# Altium project PCB_Project.PrjPcb (part 1 of 2)
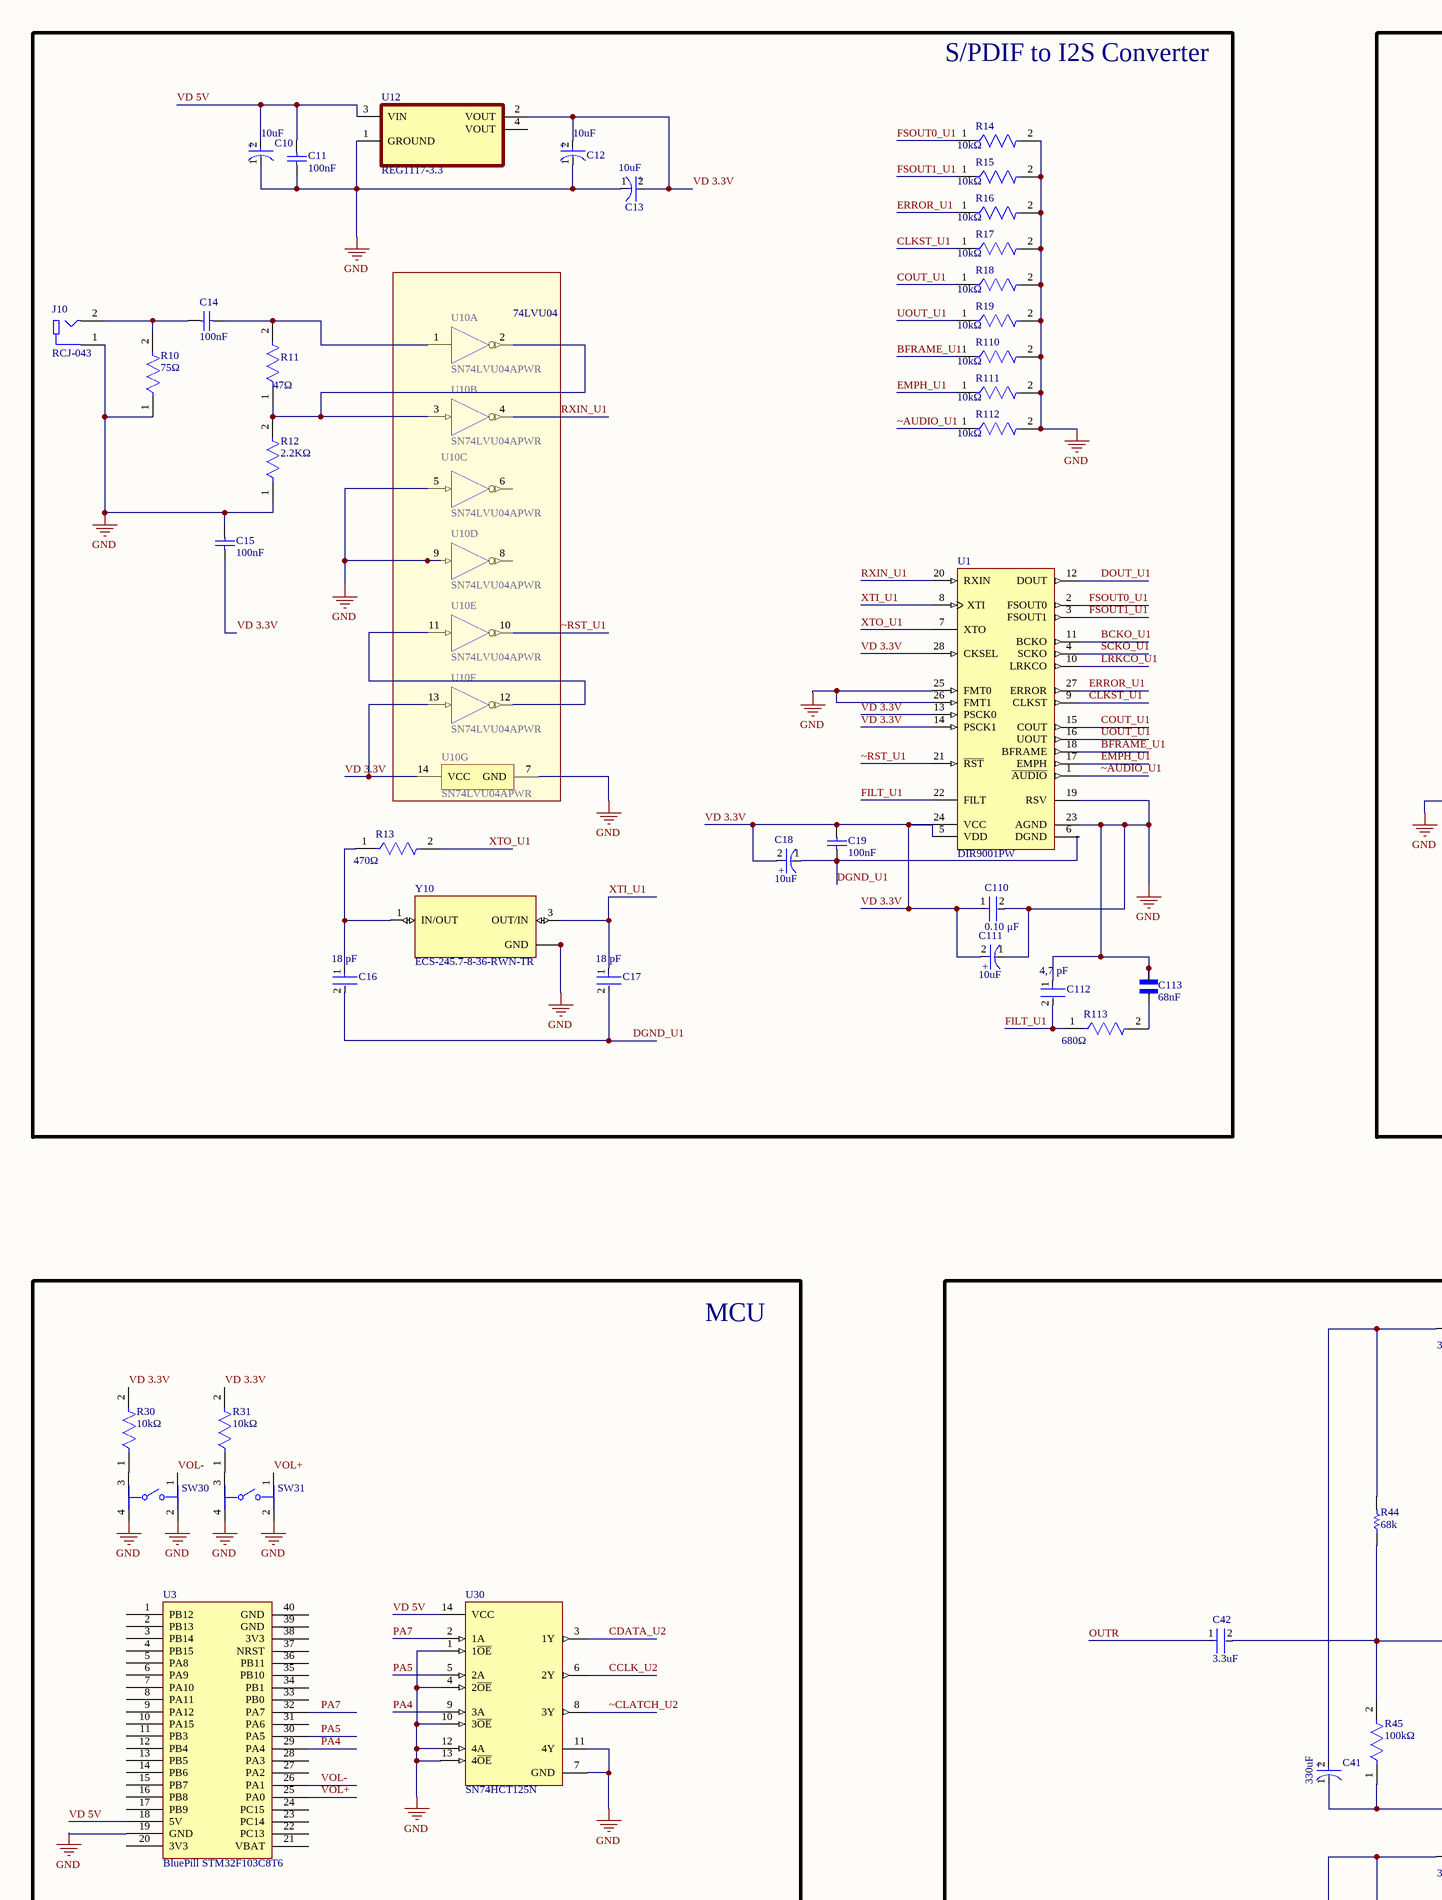
[diagram p0: Wzmacniacz audio.SchDoc, top left]
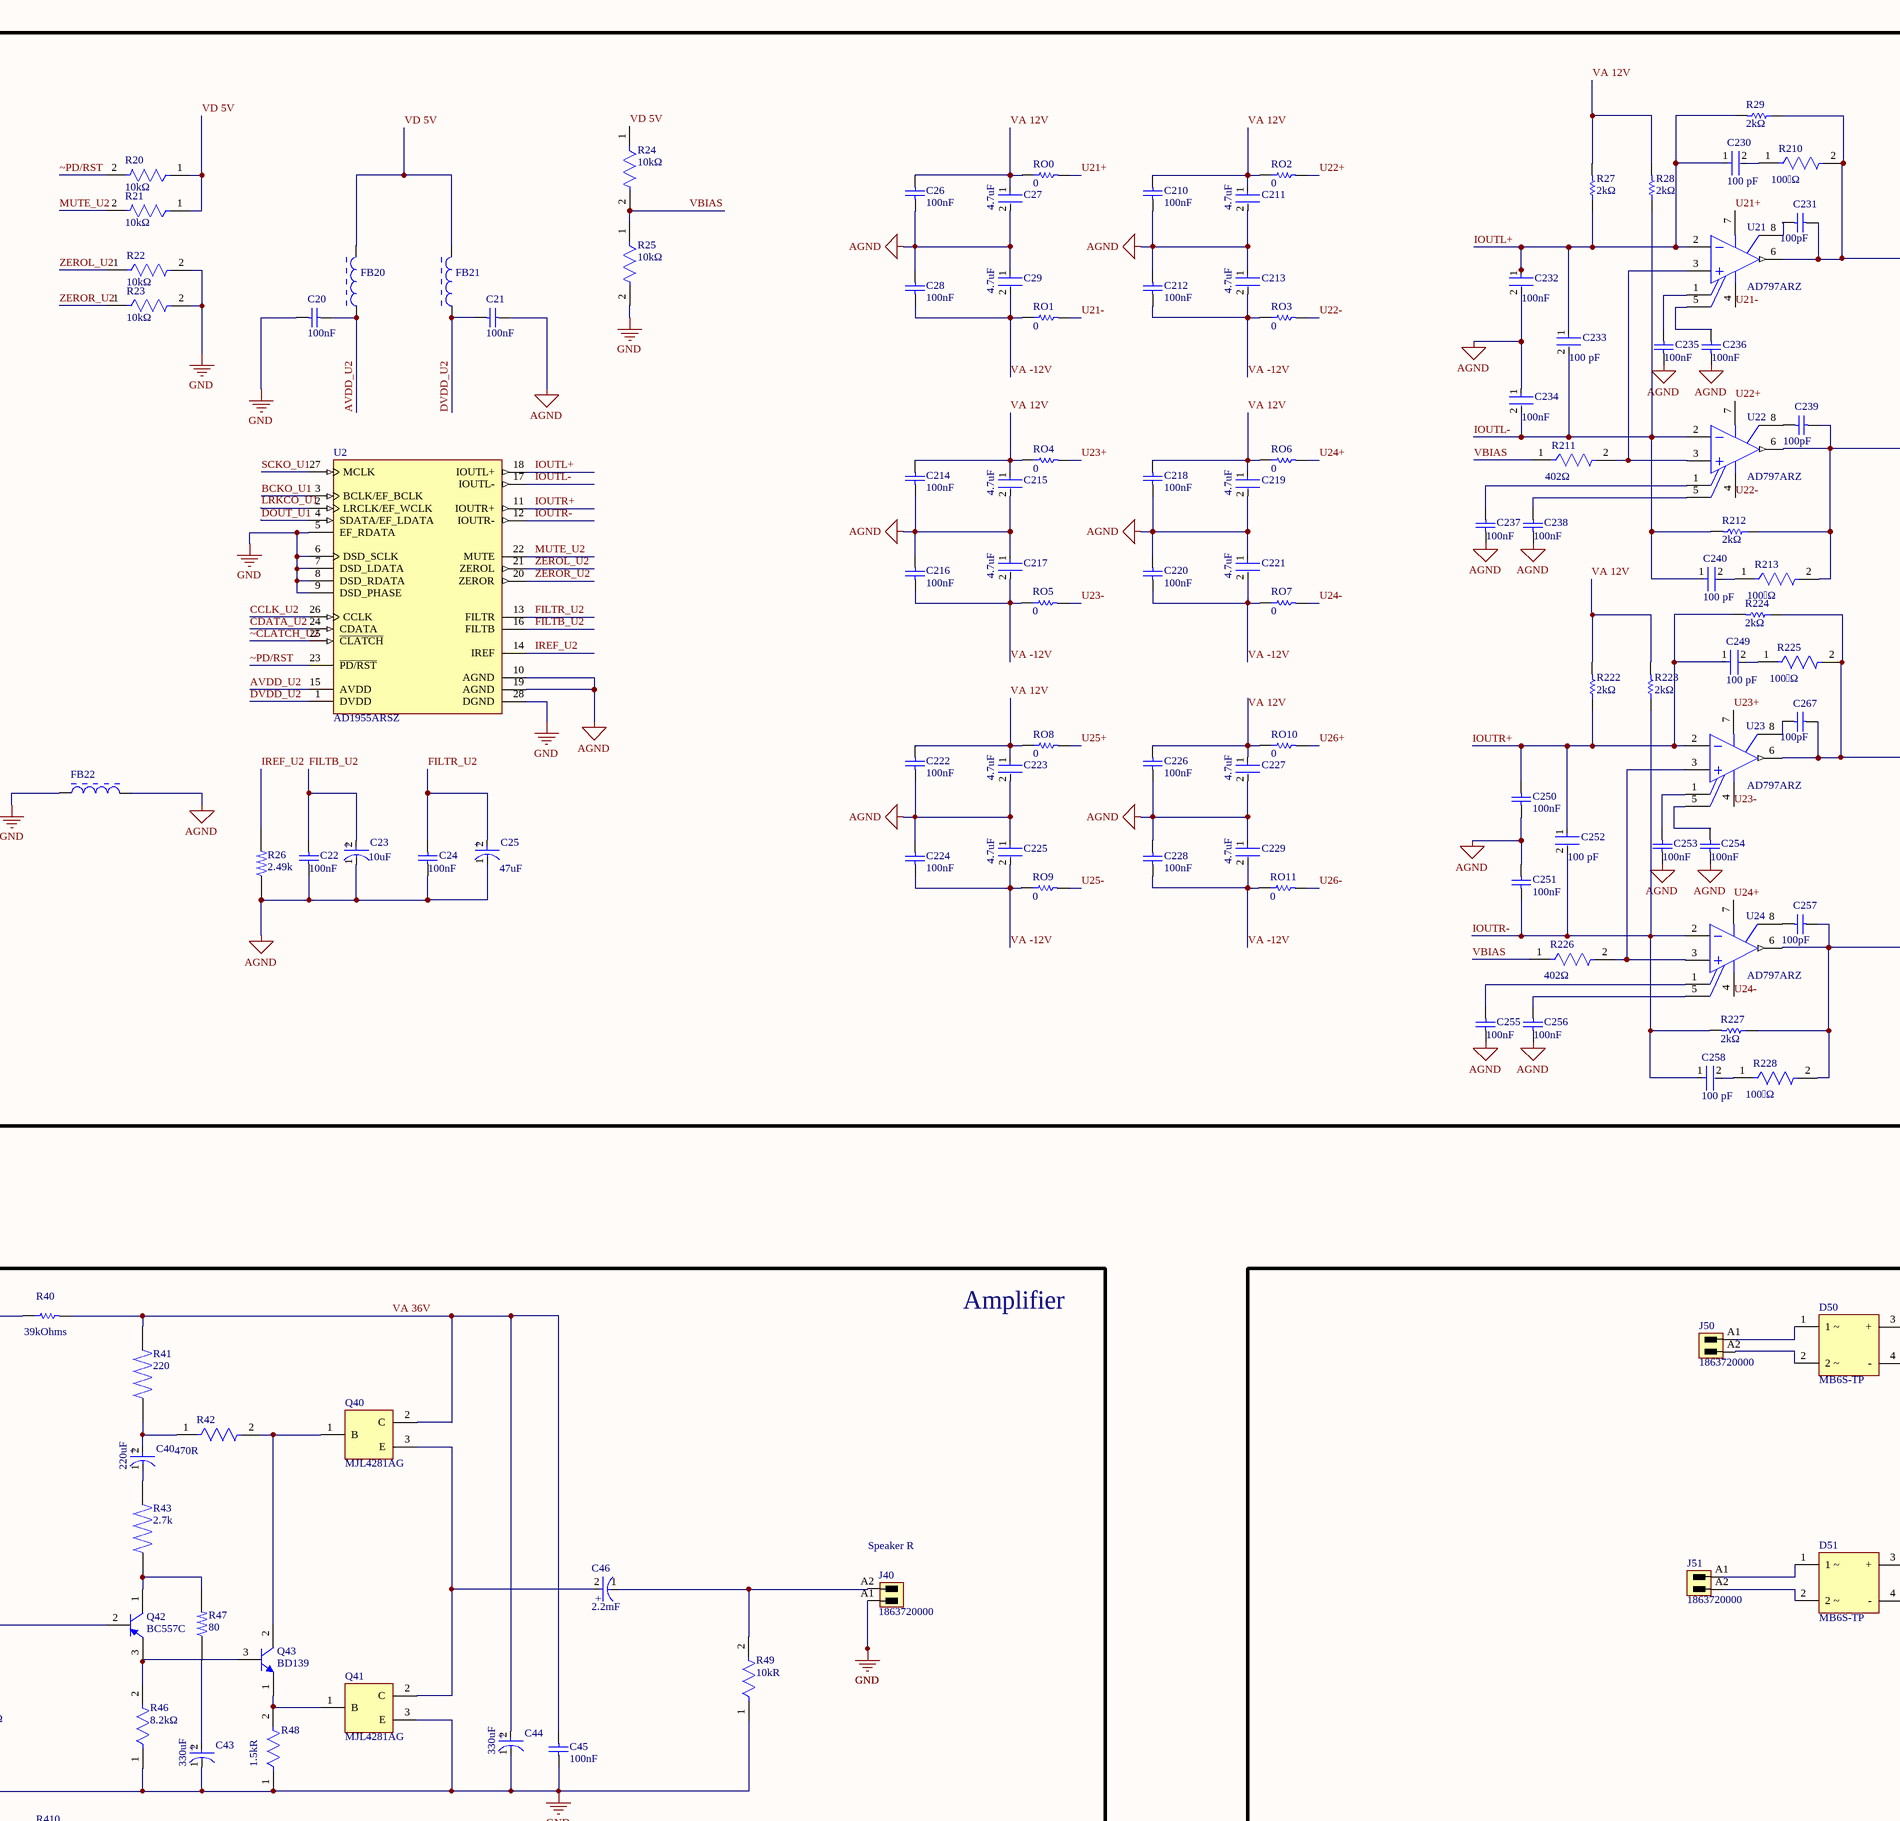
[diagram p1: Wzmacniacz audio.SchDoc, top middle]
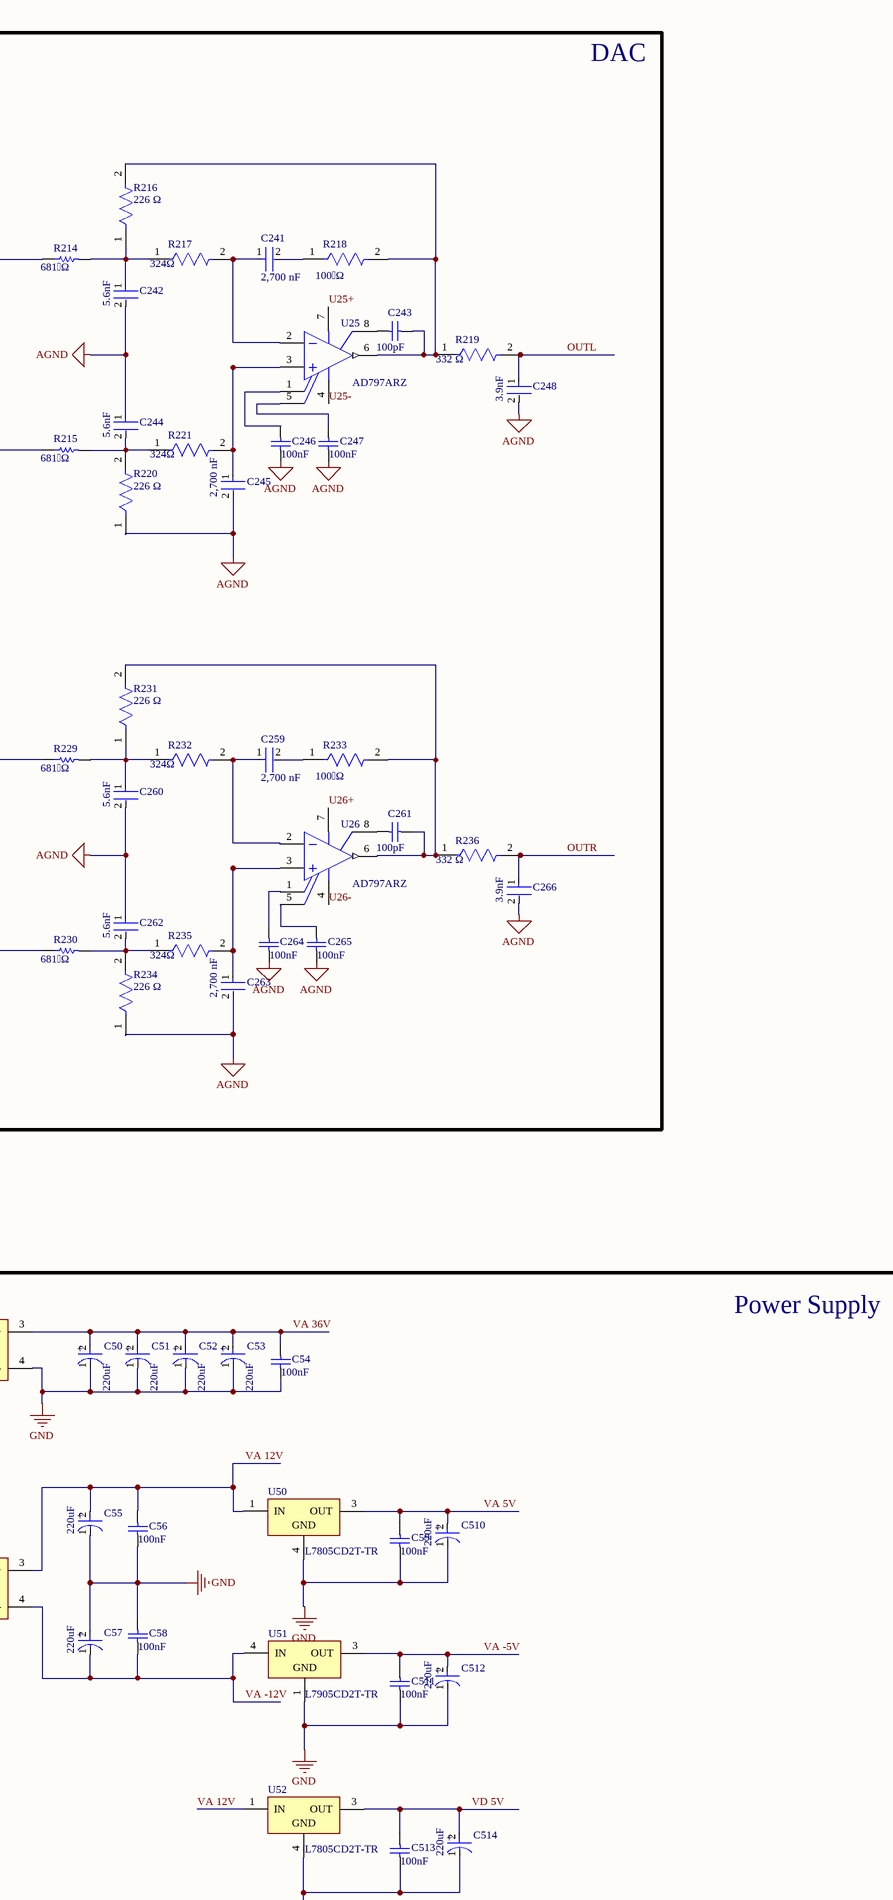
[diagram p2: Wzmacniacz audio.SchDoc, top right]
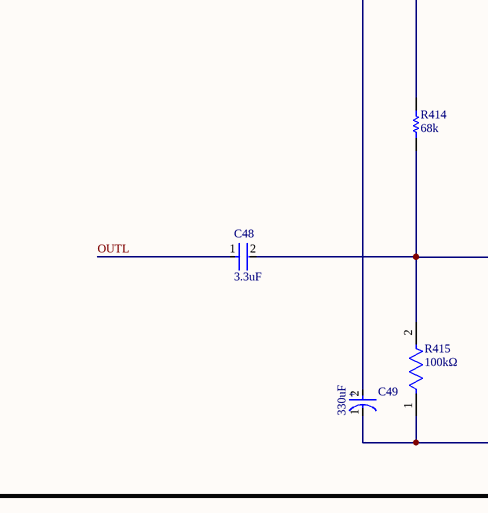
[diagram p3: Wzmacniacz audio.SchDoc, bottom left]
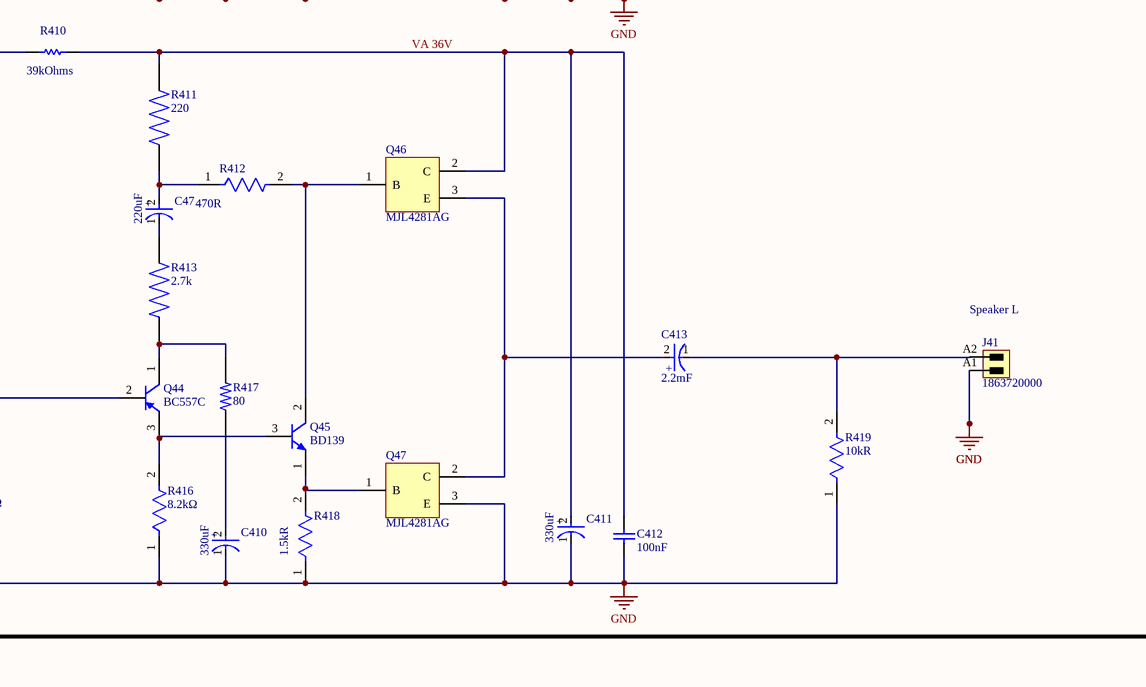
[diagram p4: Wzmacniacz audio.SchDoc, bottom middle]
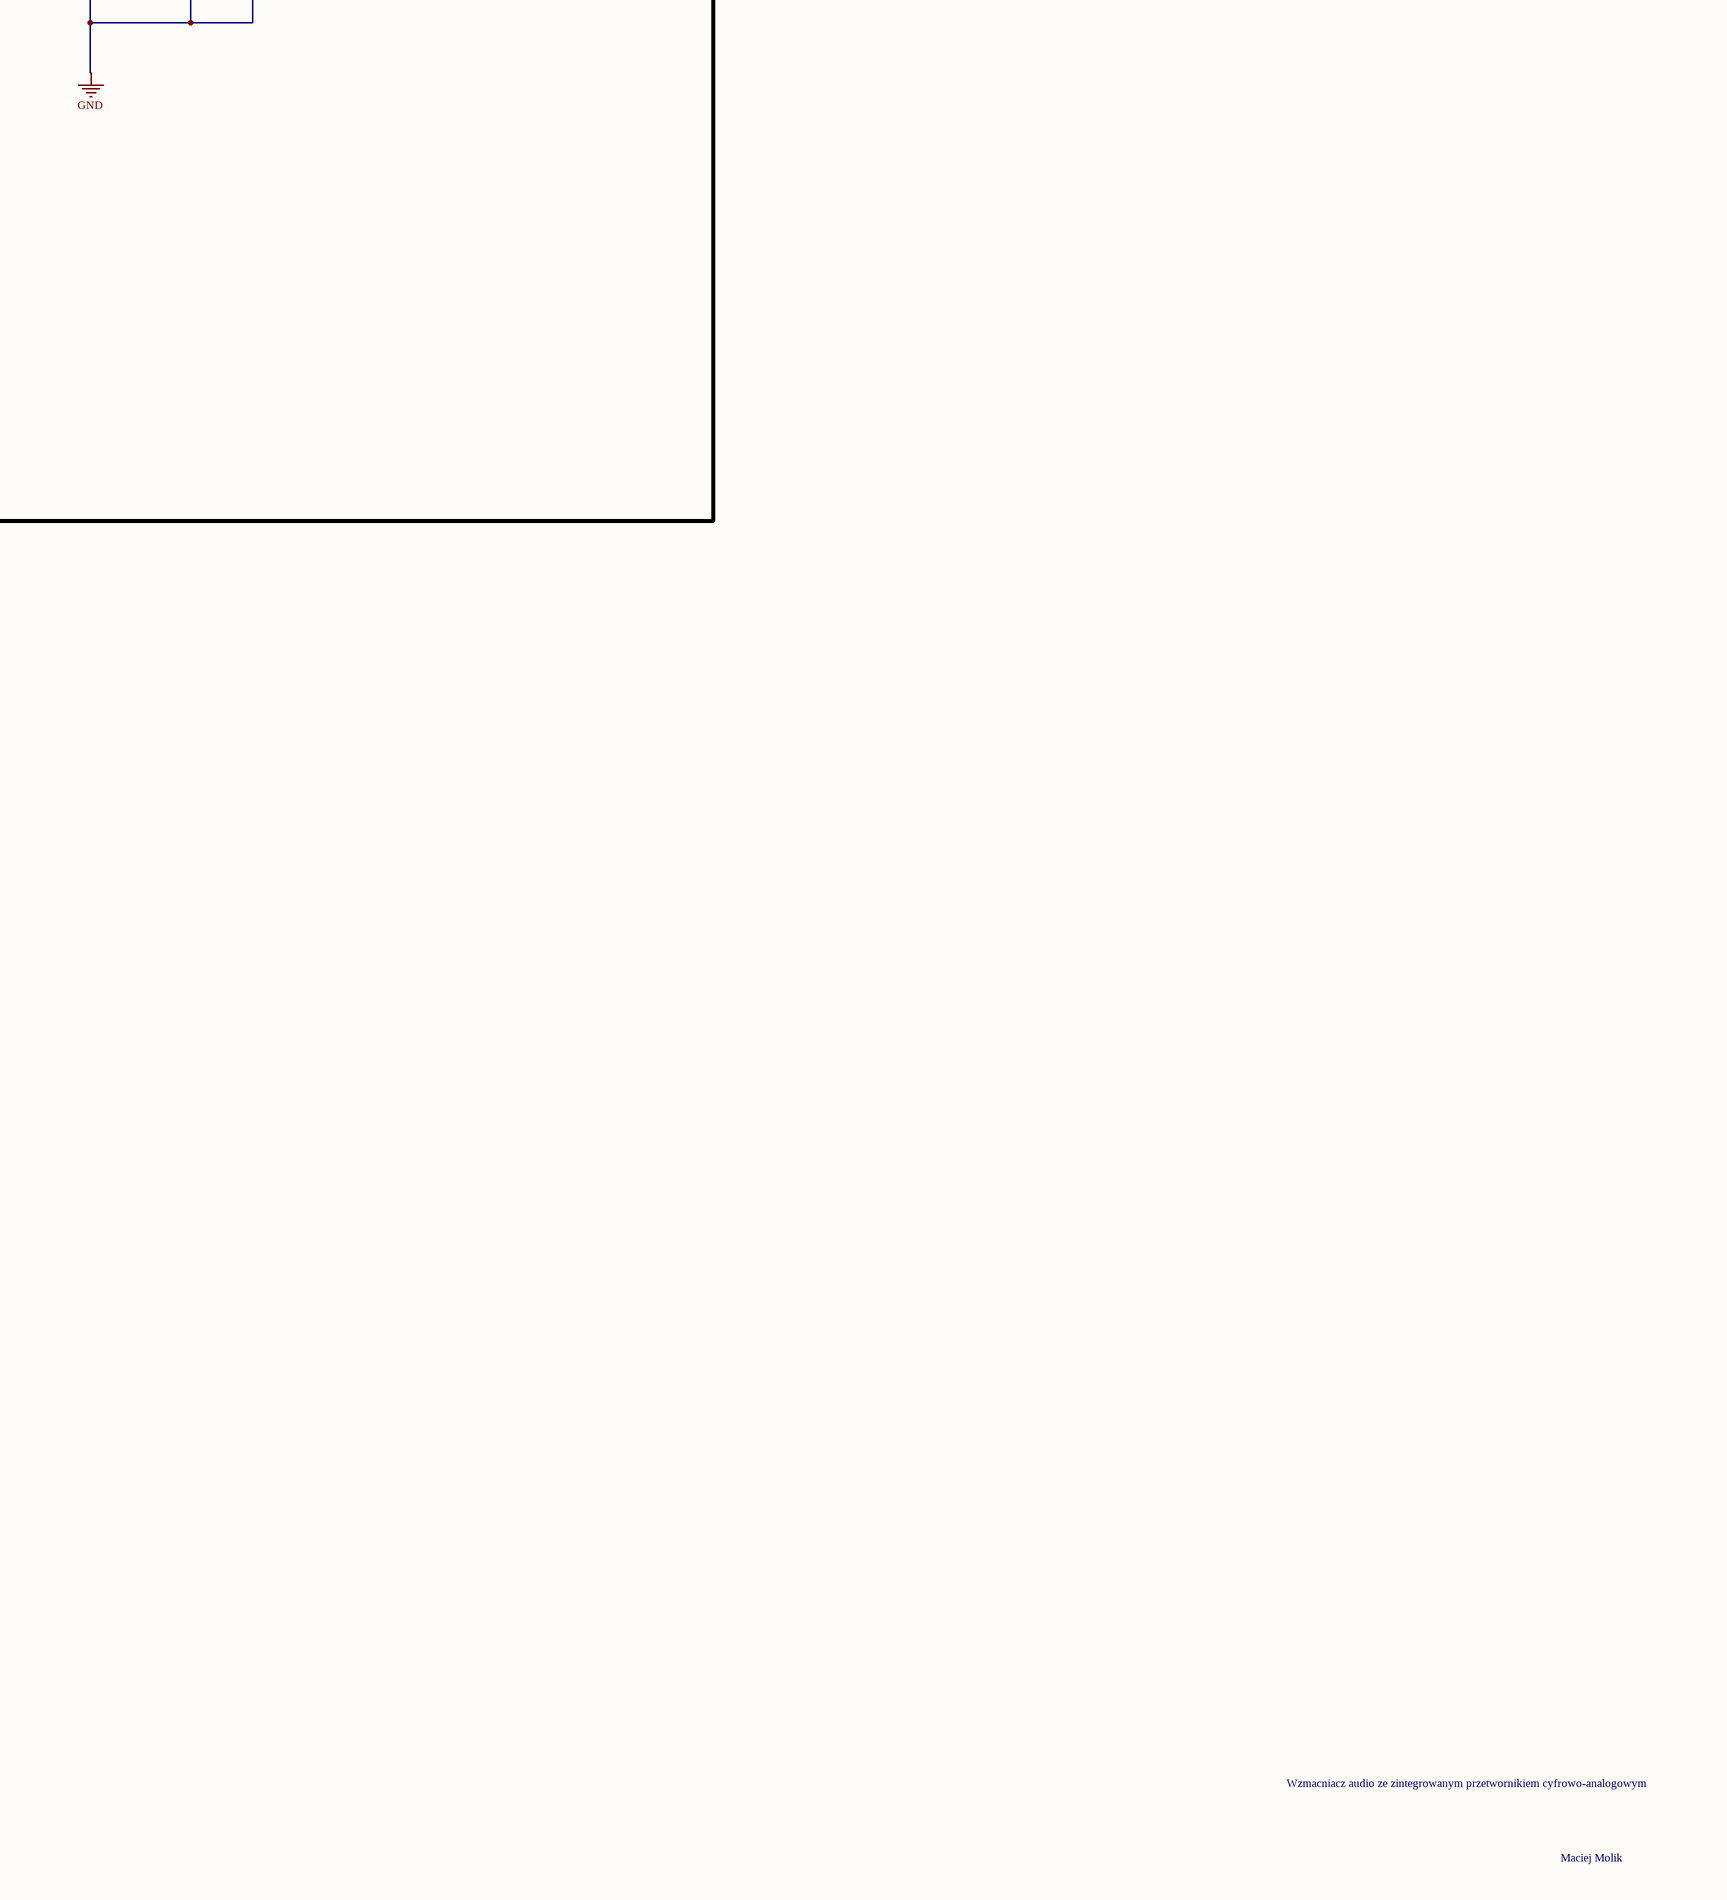
[diagram p5: Wzmacniacz audio.SchDoc, bottom right]
1 sheet, 232 parts. Net scope: global (net labels, ports and power ports of the same name join across sheets).
Board files: PCB_wzmacniacz_audio.PcbDoc, PCB_wzmacniacz_audio_v2.PcbDoc

## Sheet Wzmacniacz audio.SchDoc
size A0; SheetNumber: 1; SheetTotal: 1

### Parts
C10  Capacitance: 10uF  [FP-RAD-TH-D_5_0_5-L_11_1-MFG]  (hidden comment: EEUFC1H100LH)
C11  Capacitance: 100nF  [CAPC1608X90X35ML10T15]  (hidden comment: GRM188R71H104KA93D)
C12  Capacitance: 10uF  [FP-RAD-TH-D_5_0_5-L_11_1-MFG]  (hidden comment: EEUFC1H100LH)
C13  Capacitance: 10uF  [FP-RAD-TH-D_5_0_5-L_11_1-MFG]  (hidden comment: EEUFC1H100LH)
C14  Capacitance: 100nF  [CAPC1608X90X35ML10T15]  (hidden comment: GRM188R71H104KA93D)
C15  Capacitance: 100nF  [CAPC1608X90X35ML10T15]  (hidden comment: GRM188R71H104KA93D)
C16  Capacitance: 18 pF  [FP-C0603C-CF-MFG]  (hidden comment: C0603C180J5GACTU)
C17  Capacitance: 18 pF  [FP-C0603C-CF-MFG]  (hidden comment: C0603C180J5GACTU)
C18  Capacitance: 10uF  [FP-RAD-TH-D_5_0_5-L_11_1-MFG]  (hidden comment: EEUFC1H100LH)
C19  Capacitance: 100nF  [CAPC1608X90X35ML10T15]  (hidden comment: GRM188R71H104KA93D)
C20  Capacitance: 100nF  [CAPC1608X90X35ML10T15]  (hidden comment: GRM188R71H104KA93D)
C21  Capacitance: 100nF  [CAPC1608X90X35ML10T15]  (hidden comment: GRM188R71H104KA93D)
C22  Capacitance: 100nF  [CAPC1608X90X35ML10T15]  (hidden comment: GRM188R71H104KA93D)
C23  Capacitance: 10uF  [FP-RAD-TH-D_5_0_5-L_11_1-MFG]  (hidden comment: EEUFC1H100LH)
C24  Capacitance: 100nF  [CAPC1608X90X35ML10T15]  (hidden comment: GRM188R71H104KA93D)
C25  Capacitance: 47uF  [FP-UUX2A470MNL1GS-MFG]  (hidden comment: UUX2A470MNL1GS)
C26  Capacitance: 100nF  [CAPC1608X90X35ML10T15]  (hidden comment: GRM188R71H104KA93D)
C27  Capacitance: 4.7uF  [FP-CL10-IPC_C]  (hidden comment: CL10A475KP8NNNC)
C28  Capacitance: 100nF  [CAPC1608X90X35ML10T15]  (hidden comment: GRM188R71H104KA93D)
C29  Capacitance: 4.7uF  [FP-CL10-IPC_C]  (hidden comment: CL10A475KP8NNNC)
C40  Capacitance: 220uF  [FP-T491D-MFG]  (hidden comment: T491D227K016AT)
C41  Capacitance: 330uF  [FP-FKG-MFG]  (hidden comment: EEEFK1V331AP)
C42  Capacitance: 3.3uF  [FP-C3225-250-0_4-MFG]  (hidden comment: C3225X7R1H335K250AB)
C43  Capacitance: 330uF  [FP-FKG-MFG]  (hidden comment: EEEFK1V331AP)
C44  Capacitance: 330uF  [FP-FKG-MFG]  (hidden comment: EEEFK1V331AP)
C45  Capacitance: 100nF  [CAPC1608X90X35ML10T15]  (hidden comment: GRM188R71H104KA93D)
C46  Capacitance: 2.2mF  [FP-FKJ16-MFG]  (hidden comment: EEV-FK1E222M)
C47  Capacitance: 220uF  [FP-T491D-MFG]  (hidden comment: T491D227K016AT)
C48  Capacitance: 3.3uF  [FP-C3225-250-0_4-MFG]  (hidden comment: C3225X7R1H335K250AB)
C49  Capacitance: 330uF  [FP-FKG-MFG]  (hidden comment: EEEFK1V331AP)
C50  Capacitance: 220uF  [FP-T491D-MFG]  (hidden comment: T491D227K016AT)
C51  Capacitance: 220uF  [FP-T491D-MFG]  (hidden comment: T491D227K016AT)
C52  Capacitance: 220uF  [FP-T491D-MFG]  (hidden comment: T491D227K016AT)
C53  Capacitance: 220uF  [FP-T491D-MFG]  (hidden comment: T491D227K016AT)
C54  Capacitance: 100nF  [CAPC1608X90X35ML10T15]  (hidden comment: GRM188R71H104KA93D)
C55  Capacitance: 220uF  [FP-T491D-MFG]  (hidden comment: T491D227K016AT)
C56  Capacitance: 100nF  [CAPC1608X90X35ML10T15]  (hidden comment: GRM188R71H104KA93D)
C57  Capacitance: 220uF  [FP-T491D-MFG]  (hidden comment: T491D227K016AT)
C58  Capacitance: 100nF  [CAPC1608X90X35ML10T15]  (hidden comment: GRM188R71H104KA93D)
C59  Capacitance: 100nF  [CAPC1608X90X35ML10T15]  (hidden comment: GRM188R71H104KA93D)
C110  Capacitance: 0.10 μF  [FP-C1206C-EB-MFG]  (hidden comment: C1206C104G3GACTU)
C111  Capacitance: 10uF  [FP-RAD-TH-D_5_0_5-L_11_1-MFG]  (hidden comment: EEUFC1H100LH)
C112  value 4,7 pF  [FP-C0603C-CF-MFG]  (hidden comment: C0603C472J5GACTU)
C113  value 68nF  [CAPRR500W50L730T250H650]  (hidden comment: B32529C1683J000)
C210  Capacitance: 100nF  [CAPC1608X90X35ML10T15]  (hidden comment: GRM188R71H104KA93D)
C211  Capacitance: 4.7uF  [FP-CL10-IPC_C]  (hidden comment: CL10A475KP8NNNC)
C212  Capacitance: 100nF  [CAPC1608X90X35ML10T15]  (hidden comment: GRM188R71H104KA93D)
C213  Capacitance: 4.7uF  [FP-CL10-IPC_C]  (hidden comment: CL10A475KP8NNNC)
C214  Capacitance: 100nF  [CAPC1608X90X35ML10T15]  (hidden comment: GRM188R71H104KA93D)
C215  Capacitance: 4.7uF  [FP-CL10-IPC_C]  (hidden comment: CL10A475KP8NNNC)
C216  Capacitance: 100nF  [CAPC1608X90X35ML10T15]  (hidden comment: GRM188R71H104KA93D)
C217  Capacitance: 4.7uF  [FP-CL10-IPC_C]  (hidden comment: CL10A475KP8NNNC)
C218  Capacitance: 100nF  [CAPC1608X90X35ML10T15]  (hidden comment: GRM188R71H104KA93D)
C219  Capacitance: 4.7uF  [FP-CL10-IPC_C]  (hidden comment: CL10A475KP8NNNC)
C220  Capacitance: 100nF  [CAPC1608X90X35ML10T15]  (hidden comment: GRM188R71H104KA93D)
C221  Capacitance: 4.7uF  [FP-CL10-IPC_C]  (hidden comment: CL10A475KP8NNNC)
C222  Capacitance: 100nF  [CAPC1608X90X35ML10T15]  (hidden comment: GRM188R71H104KA93D)
C223  Capacitance: 4.7uF  [FP-CL10-IPC_C]  (hidden comment: CL10A475KP8NNNC)
C224  Capacitance: 100nF  [CAPC1608X90X35ML10T15]  (hidden comment: GRM188R71H104KA93D)
C225  Capacitance: 4.7uF  [FP-CL10-IPC_C]  (hidden comment: CL10A475KP8NNNC)
C226  Capacitance: 100nF  [CAPC1608X90X35ML10T15]  (hidden comment: GRM188R71H104KA93D)
C227  Capacitance: 4.7uF  [FP-CL10-IPC_C]  (hidden comment: CL10A475KP8NNNC)
C228  Capacitance: 100nF  [CAPC1608X90X35ML10T15]  (hidden comment: GRM188R71H104KA93D)
C229  Capacitance: 4.7uF  [FP-CL10-IPC_C]  (hidden comment: CL10A475KP8NNNC)
C230  value 100 pF  [FP-C0603C-CF-MFG]  (hidden comment: C0603C101F5GACTU)
C231  capasitance: 100pF  [CAPC1608X90X35NL10T15]  (hidden comment: GRM1885C1H101JA01D)
C232  Capacitance: 100nF  [FP-B32529C1104J000-MFG]  (hidden comment: B32529C1104J000)
C233  value 100 pF  [FP-C0603C-CF-MFG]  (hidden comment: C0603C101F5GACTU)
C234  Capacitance: 100nF  [FP-B32529C1104J000-MFG]  (hidden comment: B32529C1104J000)
C235  Capacitance: 100nF  [CAPC1608X90X35ML10T15]  (hidden comment: GRM188R71H104KA93D)
C236  Capacitance: 100nF  [CAPC1608X90X35ML10T15]  (hidden comment: GRM188R71H104KA93D)
C237  Capacitance: 100nF  [CAPC1608X90X35ML10T15]  (hidden comment: GRM188R71H104KA93D)
C238  Capacitance: 100nF  [CAPC1608X90X35ML10T15]  (hidden comment: GRM188R71H104KA93D)
C239  capasitance: 100pF  [CAPC1608X90X35NL10T15]  (hidden comment: GRM1885C1H101JA01D)
C240  value 100 pF  [FP-C0603C-CF-MFG]  (hidden comment: C0603C101F5GACTU)
C241  Capacitance: 2,700 nF  [FP-C0603C-CF-MFG]  (hidden comment: C0603C272J5GACTU)
C242  Capacitance: 5.6nF  [FP-GRM188-0_1-e0_2_0_5-IPC_A]  (hidden comment: GRM1885C1H562JA01D)
C243  capasitance: 100pF  [CAPC1608X90X35NL10T15]  (hidden comment: GRM1885C1H101JA01D)
C244  Capacitance: 5.6nF  [FP-GRM188-0_1-e0_2_0_5-IPC_A]  (hidden comment: GRM1885C1H562JA01D)
C245  Capacitance: 2,700 nF  [FP-C0603C-CF-MFG]  (hidden comment: C0603C272J5GACTU)
C246  Capacitance: 100nF  [CAPC1608X90X35ML10T15]  (hidden comment: GRM188R71H104KA93D)
C247  Capacitance: 100nF  [CAPC1608X90X35ML10T15]  (hidden comment: GRM188R71H104KA93D)
C248  Capacitance: 3.9nF  [FP-GRM188-0_1-e0_2_0_5-IPC_A]  (hidden comment: GRM1885C1H392JA01D)
C249  value 100 pF  [FP-C0603C-CF-MFG]  (hidden comment: C0603C101F5GACTU)
C250  Capacitance: 100nF  [CAPC1608X90X35ML10T15]  (hidden comment: GRM188R71H104KA93D)
C251  Capacitance: 100nF  [CAPC1608X90X35ML10T15]  (hidden comment: GRM188R71H104KA93D)
C252  value 100 pF  [FP-C0603C-CF-MFG]  (hidden comment: C0603C101F5GACTU)
C253  Capacitance: 100nF  [CAPC1608X90X35ML10T15]  (hidden comment: GRM188R71H104KA93D)
C254  Capacitance: 100nF  [CAPC1608X90X35ML10T15]  (hidden comment: GRM188R71H104KA93D)
C255  Capacitance: 100nF  [CAPC1608X90X35ML10T15]  (hidden comment: GRM188R71H104KA93D)
C256  Capacitance: 100nF  [CAPC1608X90X35ML10T15]  (hidden comment: GRM188R71H104KA93D)
C257  capasitance: 100pF  [CAPC1608X90X35NL10T15]  (hidden comment: GRM1885C1H101JA01D)
C258  value 100 pF  [FP-C0603C-CF-MFG]  (hidden comment: C0603C101F5GACTU)
C259  Capacitance: 2,700 nF  [FP-C0603C-CF-MFG]  (hidden comment: C0603C272J5GACTU)
C260  Capacitance: 5.6nF  [FP-GRM188-0_1-e0_2_0_5-IPC_A]  (hidden comment: GRM1885C1H562JA01D)
C261  capasitance: 100pF  [CAPC1608X90X35NL10T15]  (hidden comment: GRM1885C1H101JA01D)
C262  Capacitance: 5.6nF  [FP-GRM188-0_1-e0_2_0_5-IPC_A]  (hidden comment: GRM1885C1H562JA01D)
C263  Capacitance: 2,700 nF  [FP-C0603C-CF-MFG]  (hidden comment: C0603C272J5GACTU)
C264  Capacitance: 100nF  [CAPC1608X90X35ML10T15]  (hidden comment: GRM188R71H104KA93D)
C265  Capacitance: 100nF  [CAPC1608X90X35ML10T15]  (hidden comment: GRM188R71H104KA93D)
C266  Capacitance: 3.9nF  [FP-GRM188-0_1-e0_2_0_5-IPC_A]  (hidden comment: GRM1885C1H392JA01D)
C267  capasitance: 100pF  [CAPC1608X90X35NL10T15]  (hidden comment: GRM1885C1H101JA01D)
C410  Capacitance: 330uF  [FP-FKG-MFG]  (hidden comment: EEEFK1V331AP)
C411  Capacitance: 330uF  [FP-FKG-MFG]  (hidden comment: EEEFK1V331AP)
C412  Capacitance: 100nF  [CAPC1608X90X35ML10T15]  (hidden comment: GRM188R71H104KA93D)
C413  Capacitance: 2.2mF  [FP-FKJ16-MFG]  (hidden comment: EEV-FK1E222M)
C510  Capacitance: 220uF  [FP-T491D-MFG]  (hidden comment: T491D227K016AT)
C511  Capacitance: 100nF  [CAPC1608X90X35ML10T15]  (hidden comment: GRM188R71H104KA93D)
C512  Capacitance: 220uF  [FP-T491D-MFG]  (hidden comment: T491D227K016AT)
C513  Capacitance: 100nF  [CAPC1608X90X35ML10T15]  (hidden comment: GRM188R71H104KA93D)
C514  Capacitance: 220uF  [FP-T491D-MFG]  (hidden comment: T491D227K016AT)
D50  MB6S-TP  [FP-MBS-1-MFG]
D51  MB6S-TP  [FP-MBS-1-MFG]
FB20  MPZ2012S601A  [TDK-MPZ2012_V]  (value not drawn)
FB21  MPZ2012S601A  [TDK-MPZ2012_V]  (value not drawn)
FB22  MPZ2012S601A  [TDK-MPZ2012_V]  (value not drawn)
J10  RCJ-043  [CUI_RCJ-043]
J40  1863720000  [SC_SMT_3_81_180G_02]
J41  1863720000  [SC_SMT_3_81_180G_02]
J50  1863720000  [SC_SMT_3_81_180G_02]
J51  1863720000  [SC_SMT_3_81_180G_02]
Q40  MJL4281AG  [ONSC-TO-3BPL-3-340G-02]
Q41  MJL4281AG  [ONSC-TO-3BPL-3-340G-02]
Q42  BC557C  [ONSC-TO-92-3-29-11]
Q43  BD139  [ONSC-TO-225-3-77-09]
Q44  BC557C  [ONSC-TO-92-3-29-11]
Q45  BD139  [ONSC-TO-225-3-77-09]
Q46  MJL4281AG  [ONSC-TO-3BPL-3-340G-02]
Q47  MJL4281AG  [ONSC-TO-3BPL-3-340G-02]
R10  resistance: 75Ω  [FP-RN73R2A-IPC_B]  (hidden comment: RN73R2ATTD75R0F25)
R11  resistance: 47Ω  [FP-RN73R2A-IPC_B]  (hidden comment: RN73R2ATTD47R0B25)
R12  Resistance: 2.2KΩ  [FP-RT0603-MFG]  (hidden comment: RT0603FRE072K2L)
R13  resitance: 470Ω  [FP-RN73R2A-MFG]  (hidden comment: RN73R2ATTD4700B25)
R14  Resistance: 10kΩ  [FP-CRCW0603-HPe3-MFG]  (hidden comment: CRCW060310K0FKEAHP)
R15  Resistance: 10kΩ  [FP-CRCW0603-HPe3-MFG]  (hidden comment: CRCW060310K0FKEAHP)
R16  Resistance: 10kΩ  [FP-CRCW0603-HPe3-MFG]  (hidden comment: CRCW060310K0FKEAHP)
R17  Resistance: 10kΩ  [FP-CRCW0603-HPe3-MFG]  (hidden comment: CRCW060310K0FKEAHP)
R18  Resistance: 10kΩ  [FP-CRCW0603-HPe3-MFG]  (hidden comment: CRCW060310K0FKEAHP)
R19  Resistance: 10kΩ  [FP-CRCW0603-HPe3-MFG]  (hidden comment: CRCW060310K0FKEAHP)
R20  Resistance: 10kΩ  [FP-CRCW0603-HPe3-MFG]  (hidden comment: CRCW060310K0FKEAHP)
R21  Resistance: 10kΩ  [FP-CRCW0603-HPe3-MFG]  (hidden comment: CRCW060310K0FKEAHP)
R22  Resistance: 10kΩ  [FP-CRCW0603-HPe3-MFG]  (hidden comment: CRCW060310K0FKEAHP)
R23  Resistance: 10kΩ  [FP-CRCW0603-HPe3-MFG]  (hidden comment: CRCW060310K0FKEAHP)
R24  Resistance: 10kΩ  [FP-CRCW0603-HPe3-MFG]  (hidden comment: CRCW060310K0FKEAHP)
R25  Resistance: 10kΩ  [FP-CRCW0603-HPe3-MFG]  (hidden comment: CRCW060310K0FKEAHP)
R26  value 2.49k  [RESC1607X60N]  (hidden comment: RC0603FR-072K49L)
R27  RES: 2kΩ  [RESC1608X55X25ML10T15]  (hidden comment: RT0603BRD072KL)
R28  RES: 2kΩ  [RESC1608X55X25ML10T15]  (hidden comment: RT0603BRD072KL)
R29  RES: 2kΩ  [RESC1608X55X25ML10T15]  (hidden comment: RT0603BRD072KL)
R30  Resistance: 10kΩ  [FP-CRCW0603-HPe3-MFG]  (hidden comment: CRCW060310K0FKEAHP)
R31  Resistance: 10kΩ  [FP-CRCW0603-HPe3-MFG]  (hidden comment: CRCW060310K0FKEAHP)
R40  Resistance: 39kOhms  [RESC1608X55X25LL10T15]  (hidden comment: RC0603FR-0739KL)
R41  value 220  [RESC2012X75N]  (hidden comment: ERJ-P6WF2200V)
R42  Resistance: 470R  [FP-ERA3A-IPC_A]  (hidden comment: ERA-3AEB471V)
R43  value 2.7k  [RESC2012X75N]  (hidden comment: ERJ-P6WF2701V)
R44  resistance: 68k  [RESC1005X40X25ML05T05]  (hidden comment: CRCW040268K0FKED)
R45  Resistance: 100kΩ  [FP-ERA3A-MFG]  (hidden comment: ERA-3AEB104V)
R46  Resistance: 8.2kΩ  [FP-RC0603-0_55-MFG]  (hidden comment: RC0603FR-078K2L)
R47  value 80  [RESC1608X55]  (hidden comment: ERJP03F80R6V)
R48  Resistance: 1.5kR  [FP-CRCW1206-e3-IPC_C]  (hidden comment: CRCW12061K50FKEA)
R49  Resistance: 10kR  [FP-ERA3A-IPC_C]  (hidden comment: ERA-3AEB103V)
R110  Resistance: 10kΩ  [FP-CRCW0603-HPe3-MFG]  (hidden comment: CRCW060310K0FKEAHP)
R111  Resistance: 10kΩ  [FP-CRCW0603-HPe3-MFG]  (hidden comment: CRCW060310K0FKEAHP)
R112  Resistance: 10kΩ  [FP-CRCW0603-HPe3-MFG]  (hidden comment: CRCW060310K0FKEAHP)
R113  resistance: 680Ω  [FP-RN73R2A-IPC_A]  (hidden comment: RN73R2ATTD6800B25)
R210  Resistance: 100 Ω  [FP-RG1608-IPC_C]  (hidden comment: RG1608P-101-B-T5)
R211  Resistance: 402Ω  [FP-RT0402-MFG]  (hidden comment: RT0402BRD07402RL)
R212  RES: 2kΩ  [RESC1608X55X25ML10T15]  (hidden comment: RT0603BRD072KL)
R213  Resistance: 100 Ω  [FP-RG1608-IPC_C]  (hidden comment: RG1608P-101-B-T5)
R214  RESISTANCE: 681 Ω  [RESC1608X55X30ML20T20]  (hidden comment: ERA3AEB6810V)
R215  RESISTANCE: 681 Ω  [RESC1608X55X30ML20T20]  (hidden comment: ERA3AEB6810V)
R216  Resistance: 226 Ω  [FP-RG1608-MFG]  (hidden comment: RG1608P-2260-B-T5)
R217  Resistance: 324Ω  [FP-RT0603-MFG]  (hidden comment: RT0603BRD07324RL)
R218  Resistance: 100 Ω  [FP-RG1608-IPC_C]  (hidden comment: RG1608P-101-B-T5)
R219  Resistance: 332 Ω  [FP-RT0603-MFG]  (hidden comment: RT0603BRD07332RL)
R220  Resistance: 226 Ω  [FP-RG1608-MFG]  (hidden comment: RG1608P-2260-B-T5)
R221  Resistance: 324Ω  [FP-RT0603-MFG]  (hidden comment: RT0603BRD07324RL)
R222  RES: 2kΩ  [RESC1608X55X25ML10T15]  (hidden comment: RT0603BRD072KL)
R223  RES: 2kΩ  [RESC1608X55X25ML10T15]  (hidden comment: RT0603BRD072KL)
R224  RES: 2kΩ  [RESC1608X55X25ML10T15]  (hidden comment: RT0603BRD072KL)
R225  Resistance: 100 Ω  [FP-RG1608-IPC_C]  (hidden comment: RG1608P-101-B-T5)
R226  Resistance: 402Ω  [FP-RT0402-MFG]  (hidden comment: RT0402BRD07402RL)
R227  RES: 2kΩ  [RESC1608X55X25ML10T15]  (hidden comment: RT0603BRD072KL)
R228  Resistance: 100 Ω  [FP-RG1608-IPC_C]  (hidden comment: RG1608P-101-B-T5)
R229  RESISTANCE: 681 Ω  [RESC1608X55X30ML20T20]  (hidden comment: ERA3AEB6810V)
R230  RESISTANCE: 681 Ω  [RESC1608X55X30ML20T20]  (hidden comment: ERA3AEB6810V)
R231  Resistance: 226 Ω  [FP-RG1608-MFG]  (hidden comment: RG1608P-2260-B-T5)
R232  Resistance: 324Ω  [FP-RT0603-MFG]  (hidden comment: RT0603BRD07324RL)
R233  Resistance: 100 Ω  [FP-RG1608-IPC_C]  (hidden comment: RG1608P-101-B-T5)
R234  Resistance: 226 Ω  [FP-RG1608-MFG]  (hidden comment: RG1608P-2260-B-T5)
R235  Resistance: 324Ω  [FP-RT0603-MFG]  (hidden comment: RT0603BRD07324RL)
R236  Resistance: 332 Ω  [FP-RT0603-MFG]  (hidden comment: RT0603BRD07332RL)
R410  Resistance: 39kOhms  [RESC1608X55X25LL10T15]  (hidden comment: RC0603FR-0739KL)
R411  value 220  [RESC2012X75N]  (hidden comment: ERJ-P6WF2200V)
R412  Resistance: 470R  [FP-ERA3A-IPC_A]  (hidden comment: ERA-3AEB471V)
R413  value 2.7k  [RESC2012X75N]  (hidden comment: ERJ-P6WF2701V)
R414  resistance: 68k  [RESC1005X40X25ML05T05]  (hidden comment: CRCW040268K0FKED)
R415  Resistance: 100kΩ  [FP-ERA3A-MFG]  (hidden comment: ERA-3AEB104V)
R416  Resistance: 8.2kΩ  [FP-RC0603-0_55-MFG]  (hidden comment: RC0603FR-078K2L)
R417  value 80  [RESC1608X55]  (hidden comment: ERJP03F80R6V)
R418  Resistance: 1.5kR  [FP-CRCW1206-e3-IPC_C]  (hidden comment: CRCW12061K50FKEA)
R419  Resistance: 10kR  [FP-ERA3A-IPC_C]  (hidden comment: ERA-3AEB103V)
RO0  value 0  [RESC3216X60X45ML15T20]  (hidden comment: Resistor 0R +/- 5% 1206 250 mW)
RO1  value 0  [RESC3216X60X45ML15T20]  (hidden comment: Resistor 0R +/- 5% 1206 250 mW)
RO2  value 0  [RESC3216X60X45ML15T20]  (hidden comment: Resistor 0R +/- 5% 1206 250 mW)
RO3  value 0  [RESC3216X60X45ML15T20]  (hidden comment: Resistor 0R +/- 5% 1206 250 mW)
RO4  value 0  [RESC3216X60X45ML15T20]  (hidden comment: Resistor 0R +/- 5% 1206 250 mW)
RO5  value 0  [RESC3216X60X45ML15T20]  (hidden comment: Resistor 0R +/- 5% 1206 250 mW)
RO6  value 0  [RESC3216X60X45ML15T20]  (hidden comment: Resistor 0R +/- 5% 1206 250 mW)
RO7  value 0  [RESC3216X60X45ML15T20]  (hidden comment: Resistor 0R +/- 5% 1206 250 mW)
RO8  value 0  [RESC3216X60X45ML15T20]  (hidden comment: Resistor 0R +/- 5% 1206 250 mW)
RO9  value 0  [RESC3216X60X45ML15T20]  (hidden comment: Resistor 0R +/- 5% 1206 250 mW)
RO10  value 0  [RESC3216X60X45ML15T20]  (hidden comment: Resistor 0R +/- 5% 1206 250 mW)
RO11  value 0  [RESC3216X60X45ML15T20]  (hidden comment: Resistor 0R +/- 5% 1206 250 mW)
SW30  PTS645SM43SMTR92LFS  [FP-PTS645SM43SMTR92LFS-MFG]  (value not drawn)
SW31  PTS645SM43SMTR92LFS  [FP-PTS645SM43SMTR92LFS-MFG]  (value not drawn)
U1  DIR9001PW  [PW0028A_N]
U2  AD1955ARSZ  [ADI-RS-28_M]
U3  BluePill STM32F103C8T6  [Stm32 BluePill]
U10  SN74LVU04APWR  [PW0014A_L]  (parts A,B,C,D,E,F,G of 7)
U12  REG1117-3.3  [SOT230P700X180-4N]
U21  AD797ARZ  [ADI-R-8_M]
U22  AD797ARZ  [ADI-R-8_M]
U23  AD797ARZ  [ADI-R-8_M]
U24  AD797ARZ  [ADI-R-8_M]
U25  AD797ARZ  [ADI-R-8_M]
U26  AD797ARZ  [ADI-R-8_M]
U30  SN74HCT125N  [FP-N0014A-MFG]
U50  L7805CD2T-TR  [TO-263_M]
U51  L7905CD2T-TR  [TO-263_L]
U52  L7805CD2T-TR  [TO-263_M]
Y10  ECS-245.7-8-36-RWN-TR  [XTAL_ECS-245.7-8-36-RWN-TR]

### Blocks framed on the sheet
S/PDIF to I2S Converter: C10-C19 C110-C113 J10 R10-R19 R110-R113 U1 U12 Y10
DAC: C20-C29 C210-C267 FB20-FB22 R20-R29 R210-R236 RO0-RO11 U2 U21-U26
74LVU04: U10
MCU: R30 R31 SW30 SW31 U3 U30
Amplifier: C40-C49 C410-C413 J40 J41 Q40-Q47 R40-R49 R410-R419
Power Supply: C50-C59 C510-C514 D50 D51 J50 J51 U50-U52

### Nets
AGND: C21.1 C22.1 C23.1(C) C24.1 C25.1(C) C26.2 C27.2 C28.1 C29.1 C210.2 C211.2 C212.1 C213.1 C214.2 C215.2 C216.1 C217.1 C218.2 C219.2 C220.1 C221.1 C222.2 C223.2 C224.1 C225.1 C226.2 C227.2 C228.1 C229.1 C232.2 C234.1 C235.1 C236.1 C237.1 C238.1 C242.2 C244.1 C245.2 C246.1 C247.1 C248.2 C250.2 C251.1 C253.1 C254.1 C255.1 C256.1 C260.2 C262.1 C263.2 C264.1 C265.1 C266.2 FB22.2 R26.1 R220.1 R234.1 U2.10(AGND) U2.19(AGND)
GND: C10.1(C) C11.2 C12.1(C) C13.1(C) C15.1 C20.2 C41.1(C) C43.1(C) C44.1(C) C45.1 C49.1(C) C50.1(C) C51.1(C) C52.1(C) C53.1(C) C54.1 C55.1(C) C56.1 C57.2(A) C58.2 C59.1 C110.2 C111.1(C) C112.1 C113.2 C410.1(C) C411.1(C) C412.1 C510.1(C) C511.1 C512.1(C) C513.1 C514.1(C) D50.4(-) FB22.1 J10.1 J40.A1 J41.A1 Q41.3(E) Q47.3(E) R10.1 R12.1 R14.2 R15.2 R16.2 R17.2 R18.2 R19.2 R22.2 R23.2 R25.2 R45.1 R46.1 R48.1 R49.1 R110.2 R111.2 R112.2 R415.1 R416.1 R418.1 R419.1 SW30.2 SW30.4 SW31.2 SW31.4 U1.19(RSV) U1.23(AGND) U1.25(FMT0) U1.26(FMT1) U2.5(EF_RDATA) U2.6(DSD_SCLK) U2.7(DSD_LDATA) U2.8(DSD_RDATA) U2.9(DSD_PHASE) U2.28(DGND) U3.19(GND) U10.5(3A) U10.7(GND) U10.9(4A) U12.1(GROUND) U30.1(1~{OE}) U30.4(2~{OE}) U30.7(GND) U30.10(3~{OE}) U30.11(4Y) U30.12(4A) U30.13(4~{OE}) U50.4(GND) U51.1(GND) U52.4(GND) Y10.2(GND) Y10.4(GND)
AVDD_U2: C20.1 FB20.1 U2.15(AVDD)
BCKO_U1: U1.11(BCKO) U2.3(BCLK/EF_BCLK)
BFRAME_U1: R110.1 U1.18(BFRAME)
CCLK_U2: U2.26(CCLK) U30.6(2Y)
CDATA_U2: U2.24(CDATA) U30.3(1Y)
CLKST_U1: R17.1 U1.9(CLKST)
COUT_U1: R18.1 U1.15(COUT)
DGND_U1: C16.2 C17.2 C18.1(C) C19.2 U1.6(DGND)
DOUT_U1: U1.12(DOUT) U2.4(SDATA/EF_LDATA)
DVDD_U2: C21.2 FB21.1 U2.1(DVDD)
EMPH_U1: R111.1 U1.17(EMPH)
ERROR_U1: R16.1 U1.27(ERROR)
FILT_U1: C112.2 R113.1 U1.22(FILT)
FILTB_U2: C22.2 C23.2(A) U2.16(FILTB)
FILTR_U2: C24.2 C25.2(A) U2.13(FILTR)
FSOUT0_U1: R14.1 U1.2(FSOUT0)
FSOUT1_U1: R15.1 U1.3(FSOUT1)
IOUTL+: C230.1 C232.1 C233.1 R27.1 R29.2 U2.18(IOUTL+) U21.2(-IN)
IOUTL-: C233.2 C234.2 C240.1 R28.1 R212.2 U2.17(IOUTL-) U22.2(-IN)
IOUTR+: C249.1 C250.1 C252.1 R222.1 R224.2 U2.11(IOUTR+) U23.2(-IN)
IOUTR-: C251.2 C252.2 C258.1 R223.1 R227.2 U2.12(IOUTR-) U24.2(-IN)
IREF_U2: R26.2 U2.14(IREF)
LRKCO_U1: U1.10(LRKCO) U2.2(LRCLK/EF_WCLK)
MUTE_U2: R21.2 U2.22(MUTE)
OUTL: C48.1 C248.1 R219.2
OUTR: C42.1 C266.1 R236.2
PA4: U3.29(PA4) U30.9(3A)
PA5: U3.30(PA5) U30.5(2A)
PA7: U3.32(PA7) U30.2(1A)
RXIN_U1: U1.20(RXIN) U10.4(~{2Y})
SCKO_U1: U1.4(SCKO) U2.27(MCLK)
U21+: RO0.2 U21.7(+VS)
U21-: RO1.2 U21.4(-VS)
U22+: RO2.2 U22.7(+VS)
U22-: RO3.2 U22.4(-VS)
U23+: RO4.2 U23.7(+VS)
U23-: RO5.2 U23.4(-VS)
U24+: RO6.2 U24.7(+VS)
U24-: RO7.2 U24.4(-VS)
U25+: RO8.2 U25.7(+VS)
U25-: RO9.2 U25.4(-VS)
U26+: RO10.2 U26.7(+VS)
U26-: RO11.2 U26.4(-VS)
UOUT_U1: R19.1 U1.16(UOUT)
VA 5V: C59.2 C510.2(A) U50.3(OUT)
VA 12V: C26.1 C27.1 C55.2(A) C56.2 C210.1 C211.1 C214.1 C215.1 C218.1 C219.1 C222.1 C223.1 C226.1 C227.1 D51.3(+) R27.2 R28.2 R222.2 R223.2 RO0.1 RO2.1 RO4.1 RO6.1 RO8.1 RO10.1 U50.1(IN) U52.1(IN)
VA 36V: C44.2(A) C45.2 C50.2(A) C51.2(A) C52.2(A) C53.2(A) C54.2 C411.2(A) C412.2 D50.3(+) Q40.2(C) Q46.2(C) R40.2 R41.2 R410.2 R411.2
VA -5V: C511.2 C512.2(A) U51.3(OUT)
VA -12V: C28.2 C29.2 C57.1(C) C58.1 C212.2 C213.2 C216.2 C217.2 C220.2 C221.2 C224.2 C225.2 C228.2 C229.2 D51.4(-) RO1.1 RO3.1 RO5.1 RO7.1 RO9.1 RO11.1 U51.4(IN)
VBIAS: R24.2 R25.1 R211.1 R226.1
VD 3.3V: C12.2(A) C13.2(A) C15.2 C18.2(A) C19.1 C110.1 C111.2(A) R30.2 R31.2 U1.5(VDD) U1.13(PSCK0) U1.14(PSCK1) U1.24(VCC) U1.28(CKSEL) U10.13(6A) U10.14(VCC) U12.2(VOUT)
VD 5V: C10.2(A) C11.1 C513.2 C514.2(A) FB20.2 FB21.2 R20.1 R21.1 R24.1 U3.18(5V) U12.3(VIN) U30.14(VCC) U52.3(OUT)
VOL+: SW31.1 U3.25(PA0)
VOL-: SW30.1 U3.26(PA1)
XTI_U1: C17.1 U1.8(XTI) Y10.3(OUT/IN)
XTO_U1: R13.2 U1.7(XTO)
ZEROL_U2: R22.1 U2.21(ZEROL)
ZEROR_U2: R23.1 U2.20(ZEROR)
~AUDIO_U1: R112.1 U1.1(~{AUDIO})
~CLATCH_U2: U2.25(~{CLATCH}) U30.8(3Y)
~PD/RST: R20.2 U2.23(~{PD/RST})
~RST_U1: U1.21(~{RST}) U10.10(~{5Y})
NetC14_1: C14.1 R11.2 U10.1(1A)
NetC14_2: C14.2 J10.2 R10.2
NetC16_1: C16.1 R13.1 Y10.1(IN/OUT)
NetC40_1: C40.1(C) R43.2
NetC40_2: C40.2(A) R41.1 R42.1
NetC41_2: C41.2(A) R40.1 R44.2
NetC42_2: C42.2 Q42.2(B) R44.1 R45.2
NetC43_2: C43.2(A) R47.1
NetC46_1: C46.1(C) J40.A2 R49.2
NetC46_2: C46.2(A) Q40.3(E) Q41.2(C)
NetC47_1: C47.1(C) R413.2
NetC47_2: C47.2(A) R411.1 R412.1
NetC48_2: C48.2 Q44.2(B) R414.1 R415.2
NetC49_2: C49.2(A) R410.1 R414.2
NetC113_1: C113.1 R113.2
NetC230_2: C230.2 R210.1
NetC231_1: C231.1 U21.8(DECOMPENSATION_AND_DISTORTION_NEUTRALIZATION)
NetC231_2: C231.2 R29.1 R210.2 R214.1 U21.6(OUT)
NetC235_2: C235.2 U21.1(OFFSET_NULL)
NetC236_2: C236.2 U21.5(OFFSET_NULL)
NetC237_2: C237.2 U22.1(OFFSET_NULL)
NetC238_2: C238.2 U22.5(OFFSET_NULL)
NetC239_1: C239.1 R212.1 R213.2 R215.1 U22.6(OUT)
NetC239_2: C239.2 U22.8(DECOMPENSATION_AND_DISTORTION_NEUTRALIZATION)
NetC240_2: C240.2 R213.1
NetC241_1: C241.1 R217.2 U25.2(-IN)
NetC241_2: C241.2 R218.1
NetC242_1: C242.1 R214.2 R216.1 R217.1
NetC243_1: C243.1 R216.2 R218.2 R219.1 U25.6(OUT)
NetC243_2: C243.2 U25.8(DECOMPENSATION_AND_DISTORTION_NEUTRALIZATION)
NetC244_2: C244.2 R215.2 R220.2 R221.1
NetC245_1: C245.1 R221.2 U25.3(+IN)
NetC246_2: C246.2 U25.1(OFFSET_NULL)
NetC247_2: C247.2 U25.5(OFFSET_NULL)
NetC249_2: C249.2 R225.1
NetC253_2: C253.2 U23.1(OFFSET_NULL)
NetC254_2: C254.2 U23.5(OFFSET_NULL)
NetC255_2: C255.2 U24.1(OFFSET_NULL)
NetC256_2: C256.2 U24.5(OFFSET_NULL)
NetC257_1: C257.1 R227.1 R228.2 R230.1 U24.6(OUT)
NetC257_2: C257.2 U24.8(DECOMPENSATION_AND_DISTORTION_NEUTRALIZATION)
NetC258_2: C258.2 R228.1
NetC259_1: C259.1 R232.2 U26.2(-IN)
NetC259_2: C259.2 R233.1
NetC260_1: C260.1 R229.2 R231.1 R232.1
NetC261_1: C261.1 R231.2 R233.2 R236.1 U26.6(OUT)
NetC261_2: C261.2 U26.8(DECOMPENSATION_AND_DISTORTION_NEUTRALIZATION)
NetC262_2: C262.2 R230.2 R234.2 R235.1
NetC263_1: C263.1 R235.2 U26.3(+IN)
NetC264_2: C264.2 U26.1(OFFSET_NULL)
NetC265_2: C265.2 U26.5(OFFSET_NULL)
NetC267_1: C267.1 U23.8(DECOMPENSATION_AND_DISTORTION_NEUTRALIZATION)
NetC267_2: C267.2 R224.1 R225.2 R229.1 U23.6(OUT)
NetC410_2: C410.2(A) R417.1
NetC413_1: C413.1(C) J41.A2 R419.2
NetC413_2: C413.2(A) Q46.3(E) Q47.2(C)
NetD50_1: D50.1(1_~) J50.A1
NetD50_2: D50.2(2_~) J50.A2
NetD51_1: D51.1(1_~) J51.A1
NetD51_2: D51.2(2_~) J51.A2
NetQ40_1: Q40.1(B) Q43.2(C) R42.2
NetQ41_1: Q41.1(B) Q43.1(E) R48.2
NetQ42_1: Q42.1(C) R43.1 R47.2
NetQ42_3: Q42.3(E) Q43.3(B) R46.2
NetQ44_1: Q44.1(C) R413.1 R417.2
NetQ44_3: Q44.3(E) Q45.3(B) R416.2
NetQ45_1: Q45.1(E) Q47.1(B) R418.2
NetQ45_2: Q45.2(C) Q46.1(B) R412.2
NetR11_1: R11.1 R12.2 U10.2(~{1Y}) U10.3(2A)
NetR30_1: R30.1 SW30.3
NetR31_1: R31.1 SW31.3
NetR211_2: R211.2 U21.3(+IN) U22.3(+IN)
NetR226_2: R226.2 U23.3(+IN) U24.3(+IN)
NetU10_11: U10.11(5A) U10.12(~{6Y})

Not connected (* = marked no-connect by the designer): U3 1(PB12) 2(PB13) 3(PB14) 4(PB15) 5(PA8) 6(PA9) 7(PA10) 8(PA11) 9(PA12) 10(PA15) 11(PB3) 12(PB4) 13(PB5) 14(PB6) 15(PB7) 16(PB8) 17(PB9) 20(3V3) 21(VBAT) 22(PC13) 23(PC14) 24(PC15) 27(PA2) 28(PA3) 31(PA6) 33(PB0) 34(PB1) 35(PB10) 36(PB11) 37(NRST) 38(3V3) 39(GND) 40(GND); U10 6(~{3Y}) 8(~{4Y}); U12 4(VOUT)

### Notes on the sheet
- (near J40) Speaker R
- (near J41) Speaker L
- Wzmacniacz audio ze zintegrowanym przetwornikiem cyfrowo-analogowym
- Maciej Molik
- (in symbol CMP-00287-39480675-1) +
- (in symbol CMP-2000-07372-2) +
- (in symbol CMP-03017-000023-1) +
- (in symbol CMP-05427-001036-1) +
- (in symbol CMP-05427-002115-1) +